# EAGLE schematic UniversalGlucometerV3 (EAGLE 7.2.0)
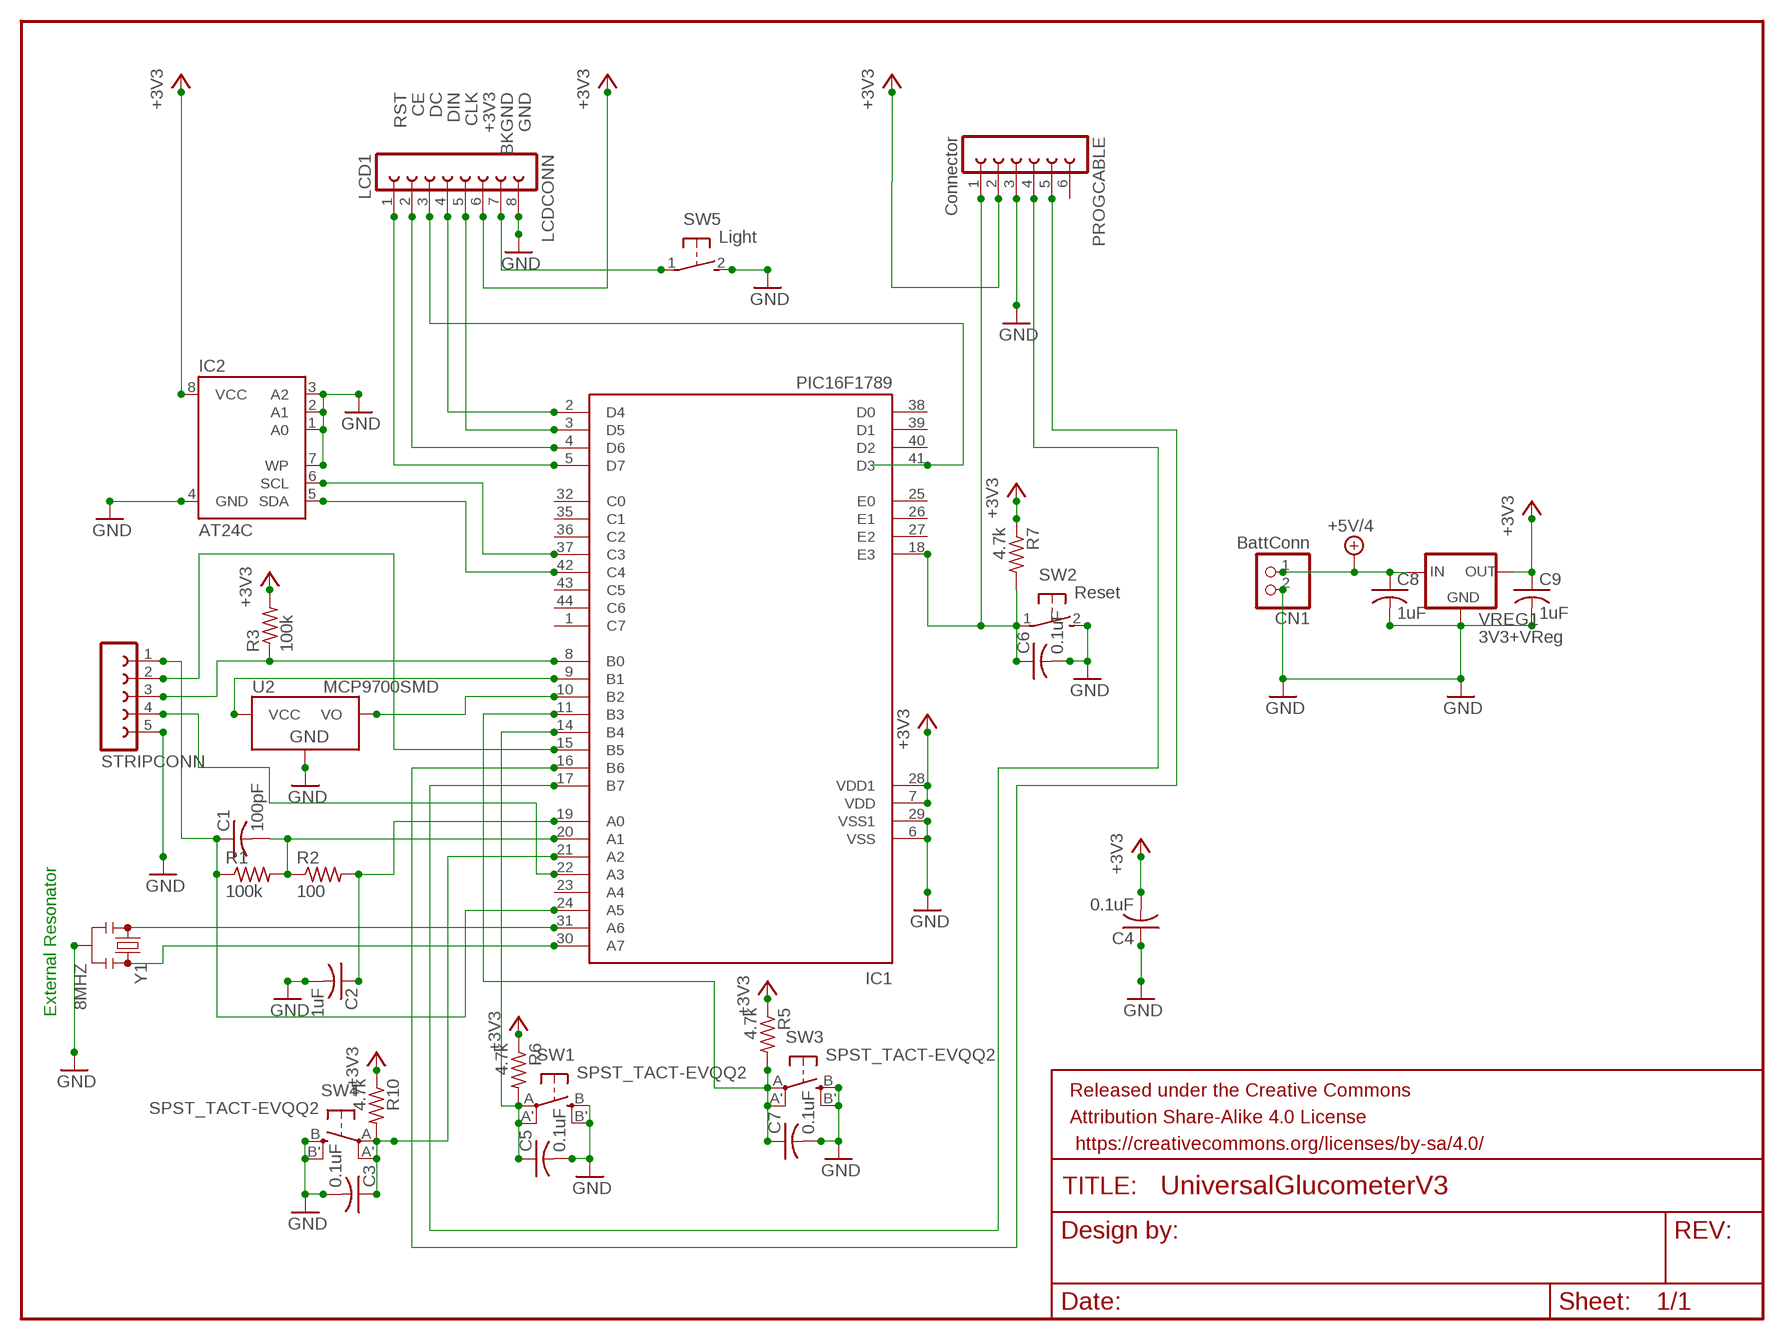
[diagram p0: schematic, sheet 1]

## Parts
C1  100pF  C-USC0805  [C0805]
C2  1uF  C-USC0805  [C0805]
C3  0.1uF  C-USC0805  [C0805]
C4  0.1uF  C-USC0805  [C0805]
C5  0.1uF  C-USC0805  [C0805]
C6  0.1uF  C-USC0805  [C0805]
C7  0.1uF  C-USC0805  [C0805]
C8  1uF  C-USC0805  [C0805]
C9  1uF  C-USC0805  [C0805]
CN1  BattConn  JST_2PIN-THM-RA  [JST-PH-2-THM-RA]
FRAME1  FRAME-LETTER  [CREATIVE_COMMONS]
IC1  PIC16F1789  [TQFP44]
IC2  AT24C  [SOIC8]
LCDCONN  LCD1  FE08-1  [FE08]
PROGCABLE  Connector  FE06-1  [FE06]
R1  100k  R-US_R0805  [R0805]
R2  100  R-US_R0805  [R0805]
R3  100k  R-US_R0805  [R0805]
R5  4.7k  R-US_R0805  [R0805]
R6  4.7k  R-US_R0805  [R0805]
R7  4.7k  R-US_R0805  [R0805]
R10  4.7k  R-US_R0805  [R0805]
STRIPCONN  FE05-1  [FE05-1]
SW1  SPST_TACT-EVQQ2  [EVQ-Q2]
SW2  Reset  31-XX  [B3F-31XX]
SW3  SPST_TACT-EVQQ2  [EVQ-Q2]
SW4  SPST_TACT-EVQQ2  [EVQ-Q2]
SW5  Light  31-XX  [B3F-31XX]
U2  MCP9700SMD  [SOT23-3]
VREG1  3V3+VReg  MCP1700SOT23-3  [SOT23-3]
Y1  8MHZ  RESONATOR8MHZ  [RESONATOR-SMD]

## Nets
+3V3: C4.2 C9.1 IC1.7(VDD) IC1.28(VDD1) IC2.8(VCC) LCDCONN.6 PROGCABLE.2 R3.2 R5.1 R6.1 R7.1 R10.1 VREG1.2(OUT)
+5V/4: C8.1 CN1.1 VREG1.3(IN)
BKGND: LCDCONN.7 SW5.1(P)
CE: IC1.4(D6) LCDCONN.2
CLK: IC1.3(D5) LCDCONN.5
DC: IC1.41(D3) LCDCONN.3
DIN: IC1.2(D4) LCDCONN.4
GND [GND]: C2.2 C3.2 C4.1 C5.2 C6.2 C7.2 C8.2 C9.2 CN1.2 IC1.6(VSS) IC1.29(VSS1) IC2.1(A0) IC2.2(A1) IC2.3(A2) IC2.4(GND) IC2.7(WP) LCDCONN.8 PROGCABLE.3 STRIPCONN.5 SW1.B'(S1) SW1.B(S) SW2.2(S) SW3.B'(S1) SW3.B(S) SW4.B'(S1) SW4.B(S) SW5.2(S) U2.3(GND) VREG1.1(GND) Y1.2
N$1: C6.1 IC1.18(E3) PROGCABLE.1 R7.2 SW2.1(P)
N$2: IC1.9(B1) U2.1(VCC)
N$3: IC1.15(B5) STRIPCONN.2
N$4: IC1.10(B2) U2.2(VO)
N$5: C5.1 IC1.14(B4) R6.2 SW1.A'(P1) SW1.A(P)
N$6: IC1.8(B0) R3.1 STRIPCONN.3
N$7: C7.1 IC1.11(B3) R5.2 SW3.A'(P1) SW3.A(P)
N$8: C1.1 IC1.24(A5) R1.1 STRIPCONN.1
N$9: IC1.31(A6) Y1.1
N$10: IC1.37(C3) IC2.6(SCL)
N$11: IC1.42(C4) IC2.5(SDA)
N$12: IC1.30(A7) Y1.3
N$13 [+3V3]: IC1.22(A3) STRIPCONN.4
N$14: C2.1 IC1.19(A0) R2.2
N$18: C3.1 IC1.21(A2) R10.2 SW4.A'(P1) SW4.A(P)
N$23: C1.2 IC1.20(A1) R1.2 R2.1
N$25: IC1.17(B7) PROGCABLE.4
N$26: IC1.16(B6) PROGCABLE.5
RST: IC1.5(D7) LCDCONN.1
Unconnected: IC1.1(C7) IC1.23(A4) IC1.25(E0) IC1.26(E1) IC1.27(E2) IC1.32(C0) IC1.35(C1) IC1.36(C2) IC1.38(D0) IC1.39(D1) IC1.40(D2) IC1.43(C5) IC1.44(C6) PROGCABLE.6

## Notes on the sheet
- External Resonator

## Library data of the parts
C1-C9 = adafruit:C-US: CAPACITOR, American symbol
CN1 = adafruit:JST_2PIN: JST 2-Pin Connectors of various flavors SMT-RA (S2B-PH-SM4) 4UConnector #17311 SMT (B2B-PH-SM4) THM-RA (S2B-PH) THM (B2B-PH)
FRAME1 = SparkFun-Aesthetics:FRAME-LETTER: Schematic Frame Standard 8.5x11 US Letter frame
IC1 = PIC16F1789:PIC16F1789
IC2 = ATMEL-EEPROM:AT24C*: 2-wire serial EEPROM
LCDCONN = con-lsta:FE08-1: FEMALE HEADER; OC_FARNELL: unknown; OC_NEWARK: unknown
PROGCABLE = con-lsta:FE06-1: FEMALE HEADER; OC_FARNELL: unknown; OC_NEWARK: unknown
R1-R3 R5-R7 R10 = adafruit:R-US_: RESISTOR, American symbol
STRIPCONN = con-lsta:FE05-1: FEMALE HEADER; OC_FARNELL: unknown; OC_NEWARK: unknown
SW1 SW3 SW4 = adafruit:SPST_TACT: SMT 6mm switch, EVQQ2 series http://www.ladyada.net/library/eagle
SW2 SW5 = adafruit:31-XX: OMRON SWITCH Now with beefier pads!
U2 = SparkFun-Sensors:MCP9700: Analog-output temperature sensor; PROD_ID: IC-08917
VREG1 = mylibrary:MCP1700: VOLTAGE REGULATOR
Y1 = SparkFun-FreqCtrl:RESONATOR: Resonator Small SMD resonator. Used, eg, on the Arduino Pro/ Pro Mini boards. 8MHz- XTAL-08895 16MHz- XTAL-08900; PROD_ID: XTAL-08895

## Net classes
0 default: width 0.406 mm, clearance 0.205 mm
1 GND: width 0.61 mm
2 +3V3: width 0.61 mm